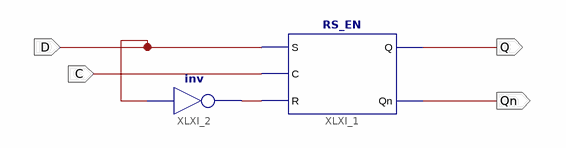
[diagram p0: schematic sheet 1]
// Xilinx ISE schematic D_EN.sch (kintex7) as structural Verilog: 2 symbols, 4 ports
module D_EN (
  input  C,
  input  D,
  output Q,
  output Qn
);

  wire XLXN_4;

  RS_EN XLXI_1 (.S(D), .C(C), .R(XLXN_4), .Q(Q), .Qn(Qn));
  not XLXI_2 (XLXN_4, D);
endmodule
